# EAGLE design LAN9303_Nucleo144_Shield (EAGLE 9.1.3)
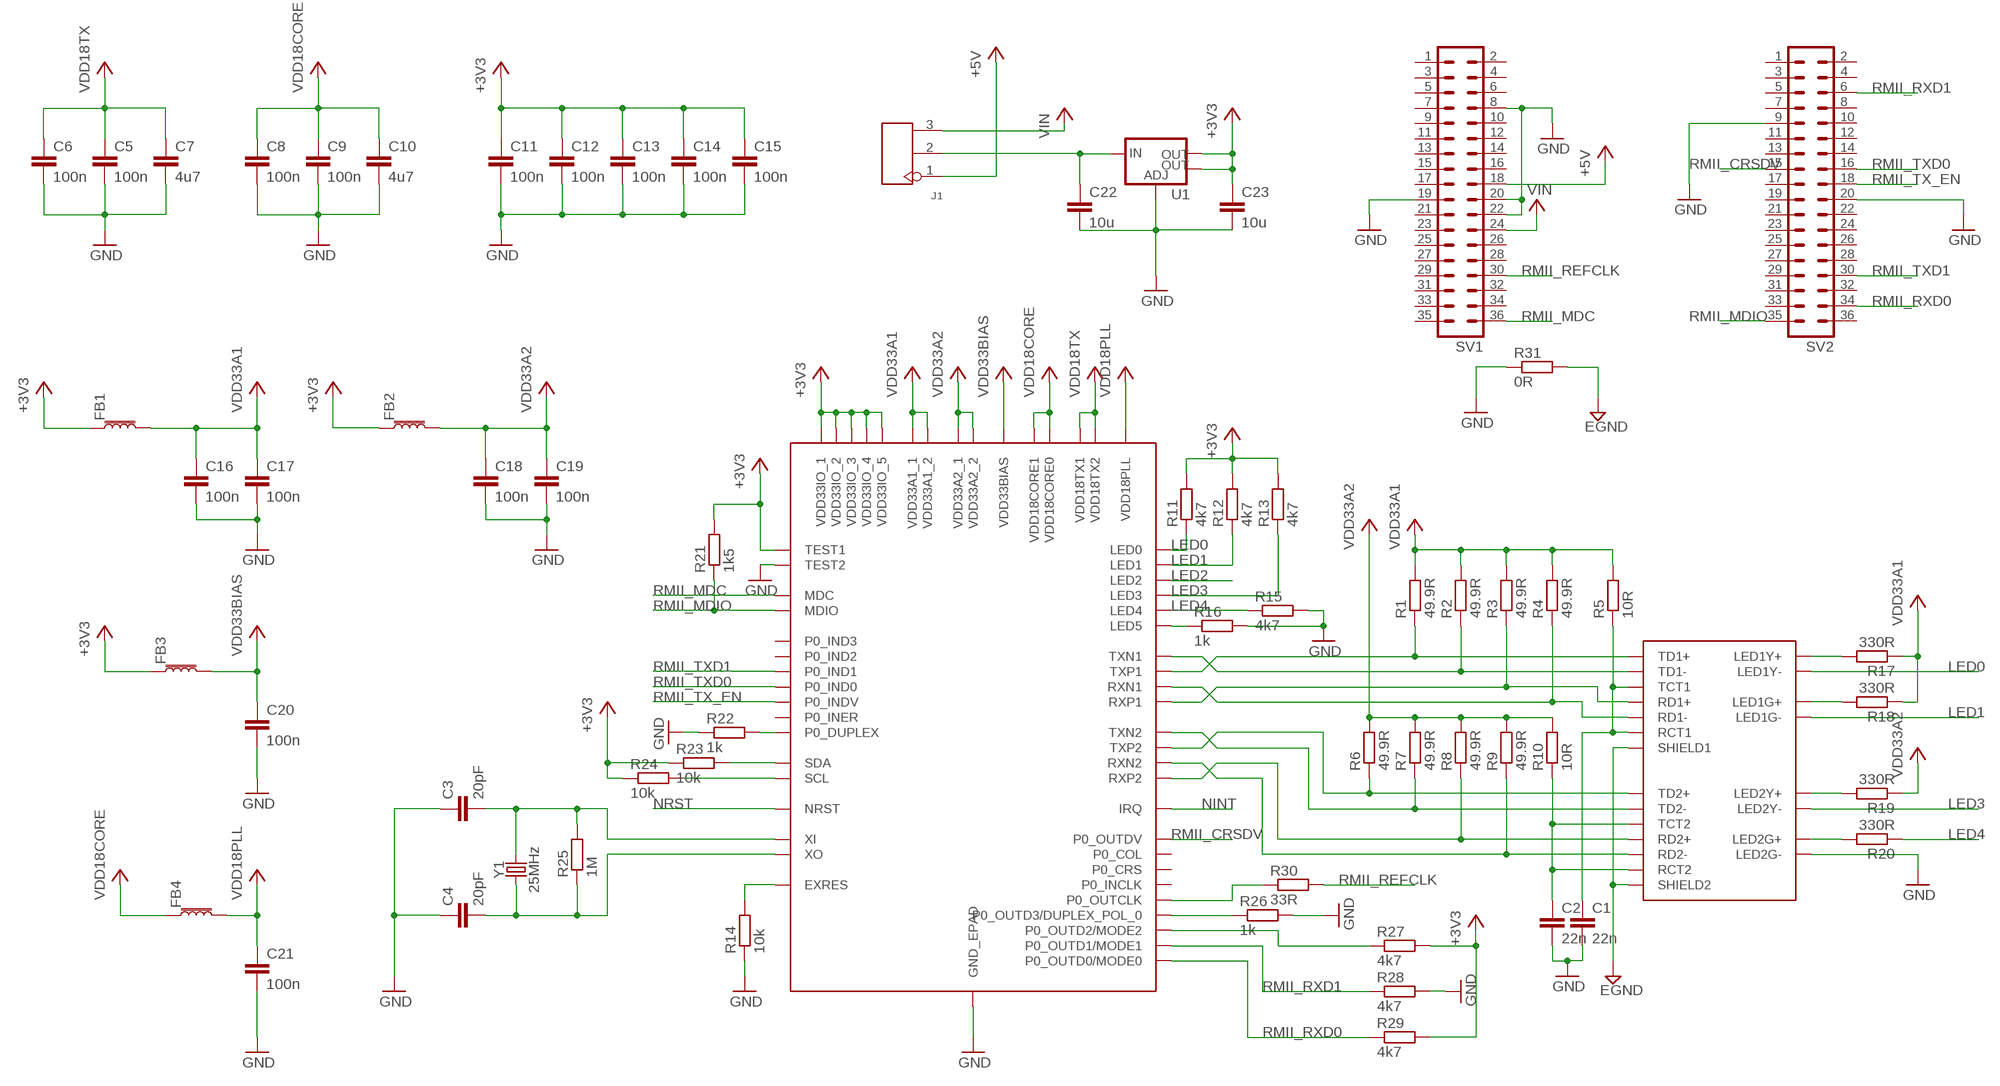
[diagram p0: schematic, sheet 1]

## Parts
C1  22n  C-EUC0603  [C0603]
C2  22n  C-EUC0603  [C0603]
C3  20pF  C-EUC0603  [C0603]
C4  20pF  C-EUC0603  [C0603]
C5  100n  C-EUC0603  [C0603]
C6  100n  C-EUC0603  [C0603]
C7  4u7  C-EUC0603  [C0603]
C8  100n  C-EUC0603  [C0603]
C9  100n  C-EUC0603  [C0603]
C10  4u7  C-EUC0603  [C0603]
C11  100n  C-EUC0603  [C0603]
C12  100n  C-EUC0603  [C0603]
C13  100n  C-EUC0603  [C0603]
C14  100n  C-EUC0603  [C0603]
C15  100n  C-EUC0603  [C0603]
C16  100n  C-EUC0603  [C0603]
C17  100n  C-EUC0603  [C0603]
C18  100n  C-EUC0603  [C0603]
C19  100n  C-EUC0603  [C0603]
C20  100n  C-EUC0603  [C0603]
C21  100n  C-EUC0603  [C0603]
C22  10u  C-EUC1206  [C1206]
C23  10u  C-EUC1206  [C1206]
FB1  FERRITE_BEAD-0603  [0603]
FB2  FERRITE_BEAD-0603  [0603]
FB3  FERRITE_BEAD-0603  [0603]
FB4  FERRITE_BEAD-0603  [0603]
J1  DIP-BLACK-FEMALE-HEADER-VERT(3P-2.54)  [H3-2.54]
R1  49.9R  R-EU_R0603  [R0603]
R2  49.9R  R-EU_R0603  [R0603]
R3  49.9R  R-EU_R0603  [R0603]
R4  49.9R  R-EU_R0603  [R0603]
R5  10R  R-EU_R0603  [R0603]
R6  49.9R  R-EU_R0603  [R0603]
R7  49.9R  R-EU_R0603  [R0603]
R8  49.9R  R-EU_R0603  [R0603]
R9  49.9R  R-EU_R0603  [R0603]
R10  10R  R-EU_R0603  [R0603]
R11  4k7  R-EU_R0603  [R0603]
R12  4k7  R-EU_R0603  [R0603]
R13  4k7  R-EU_R0603  [R0603]
R14  10k  R-EU_R0603  [R0603]
R15  4k7  R-EU_R0603  [R0603]
R16  1k  R-EU_R0603  [R0603]
R17  330R  R-EU_R0603  [R0603]
R18  330R  R-EU_R0603  [R0603]
R19  330R  R-EU_R0603  [R0603]
R20  330R  R-EU_R0603  [R0603]
R21  1k5  R-EU_R0603  [R0603]
R22  1k  R-EU_R0603  [R0603]
R23  10k  R-EU_R0603  [R0603]
R24  10k  R-EU_R0603  [R0603]
R25  1M  R-EU_R0603  [R0603]
R26  1k  R-EU_R0603  [R0603]
R27  4k7  R-EU_R0603  [R0603]
R28  4k7  R-EU_R0603  [R0603]
R29  4k7  R-EU_R0603  [R0603]
R30  33R  R-EU_R0603  [R0603]
R31  0R  R-EU_R0805  [R0805]
SV1  MA18-2  [MA18-2]
SV2  MA18-2  [MA18-2]
U1  V_REG_LM1117SOT223  [SOT223]
U$1  LAN9303  LAN9303_ABZJ  [QFN56]
U$2  WE_DUAL_RJ45JACK  [DUAL_RJ45]
Y1  25MHz  CRYSTALSMD-5X3.2-2PAD  [CRYSTAL-SMD-5X3.2-2PAD]

## Nets
+3V3: C11.1 C12.1 C13.1 C14.1 C15.1 C23.1 FB1.1 FB2.1 FB3.1 R11.2 R12.2 R13.2 R21.2 R23.1 R24.1 R27.2 R29.2 U1.2(OUT) U1.4(OUT) U$1.9(VDD33IO_1) U$1.15(VDD33IO_2) U$1.23(VDD33IO_3) U$1.30(VDD33IO_4) U$1.32(VDD33IO_5) U$1.33(TEST1)
+5V: J1.1 SV1.18
CLK_IN: R30.1 U$1.17(P0_OUTCLK)
GND: C1.2 C2.2 C3.1 C4.1 C5.2 C6.2 C7.2 C8.2 C9.2 C10.2 C11.2 C12.2 C13.2 C14.2 C15.2 C16.2 C17.2 C18.2 C19.2 C20.2 C21.2 C22.2 C23.2 R14.1 R15.2 R16.2 R22.1 R26.2 R28.2 R31.1 SV1.8 SV1.19 SV1.20 SV1.22 SV2.9 SV2.20 U1.1(ADJ) U$1.34(TEST2) U$1.EPAD(GND_EPAD) U$2.P$2_12(LED2G-)
GND1: R31.2 U$2.P$1_8(SHIELD1) U$2.P$2_8(SHIELD2) ; supply symbol labelled EGND
LED0: R11.1 U$1.29(LED0) U$2.P$1_10(LED1Y-)
LED1: R12.1 U$1.28(LED1) U$2.P$1_12(LED1G-)
LED2: U$1.27(LED2)
LED3: R13.1 U$1.26(LED3) U$2.P$2_10(LED2Y-)
LED4: R15.1 R20.1 U$1.25(LED4)
N$6: C2.1 R10.1 U$2.P$2_4(TCT2) U$2.P$2_5(RCT2)
N$9: C1.1 R5.1 U$2.P$1_4(TCT1) U$2.P$1_5(RCT1)
N$12: R22.2 U$1.20(P0_DUPLEX)
N$13: R16.1 U$1.24(LED5)
N$14: R17.2 U$2.P$1_9(LED1Y+)
N$15: R19.2 U$2.P$2_9(LED2Y+)
N$16: R20.2 U$2.P$2_11(LED2G+)
N$17: R18.2 U$2.P$1_11(LED1G+)
N$18: R23.2 U$1.35(SDA)
N$19: R24.2 U$1.36(SCL)
N$20: R14.2 U$1.49(EXRES)
N$21: R27.1 U$1.12(P0_OUTD2/MODE2)
N$22: C22.1 J1.2 U1.3(IN)
N$23: C3.2 R25.2 U$1.39(XI) Y1.P$2
N$24: C4.2 R25.1 U$1.40(XO) Y1.P$1
N$25: R26.1 U$1.11(P0_OUTD3/DUPLEX_POL_0)
NINT: U$1.38(IRQ)
NRST: U$1.37(NRST)
RMII_CRSDV: SV2.15 U$1.16(P0_OUTDV)
RMII_MDC: SV1.36 U$1.22(MDC)
RMII_MDIO: R21.1 SV2.35 U$1.21(MDIO)
RMII_REFCLK: R30.2 SV1.30
RMII_RXD0: R29.1 SV2.34 U$1.14(P0_OUTD0/MODE0)
RMII_RXD1: R28.1 SV2.6 U$1.13(P0_OUTD1/MODE1)
RMII_TX_EN: SV2.18 U$1.6(P0_INDV)
RMII_TXD0: SV2.16 U$1.5(P0_IND0)
RMII_TXD1: SV2.30 U$1.4(P0_IND1)
RXN1: R4.1 U$1.45(RXN1) U$2.P$1_6(RD1-)
RXN2: R9.1 U$1.54(RXN2) U$2.P$2_6(RD2-)
RXP1: R3.1 U$1.46(RXP1) U$2.P$1_3(RD1+)
RXP2: R8.1 U$1.53(RXP2) U$2.P$2_3(RD2+)
TXN1: R2.1 U$1.42(TXN1) U$2.P$1_2(TD1-)
TXN2: R7.1 U$1.1(TXN2) U$2.P$2_2(TD2-)
TXP1: R1.1 U$1.43(TXP1) U$2.P$1_1(TD1+)
TXP2: R6.1 U$1.56(TXP2) U$2.P$2_1(TD2+)
VDD18CORE: C8.1 C9.1 C10.1 FB4.1 U$1.10(VDD18CORE0) U$1.31(VDD18CORE1)
VDD18PLL: C21.1 FB4.2 U$1.41(VDD18PLL)
VDD18TX: C5.1 C6.1 C7.1 U$1.48(VDD18TX1) U$1.51(VDD18TX2)
VDD33A1: C16.1 C17.1 FB1.2 R1.2 R2.2 R3.2 R4.2 R5.2 R17.1 R18.1 U$1.44(VDD33A1_1) U$1.47(VDD33A1_2)
VDD33A2: C18.1 C19.1 FB2.2 R6.2 R7.2 R8.2 R9.2 R10.2 R19.1 U$1.52(VDD33A2_1) U$1.55(VDD33A2_2)
VDD33BIAS: C20.1 FB3.2 U$1.50(VDD33BIAS)
VIN: J1.3 SV1.24
Unconnected: SV1.1 SV1.2 SV1.3 SV1.4 SV1.5 SV1.6 SV1.7 SV1.9 SV1.10 SV1.11 SV1.12 SV1.13 SV1.14 SV1.15 SV1.16 SV1.17 SV1.21 SV1.23 SV1.25 SV1.26 SV1.27 SV1.28 SV1.29 SV1.31 SV1.32 SV1.33 SV1.34 SV1.35 SV2.1 SV2.2 SV2.3 SV2.4 SV2.5 SV2.7 SV2.8 SV2.10 SV2.11 SV2.12 SV2.13 SV2.14 SV2.17 SV2.19 SV2.21 SV2.22 SV2.23 SV2.24 SV2.25 SV2.26 SV2.27 SV2.28 SV2.29 SV2.31 SV2.32 SV2.33 SV2.36 U$1.2(P0_IND3) U$1.3(P0_IND2) U$1.7(P0_INER) U$1.8(P0_INCLK) U$1.18(P0_COL) U$1.19(P0_CRS)

## Library data of the parts
C1-C23 = rcl:C-EU: CAPACITOR, European symbol
FB1-FB4 = SparkFun-Coils:FERRITE_BEAD: Ferrite Bead (blocks, cores, rings, chokes, etc.) Inductor with layers of ferrite used to suppress high frequencies. Often used to isolate high frequency noise. SparkFun Products: IOIO-OTG - V2.2 <https://www.sparkfun.com/products/13613> SparkFun SAMD21 Mini Breakout <https://www.sparkfun.com/products/13664> SparkFun 6 Degrees of Freedom Breakout - LSM6DS3 <https://www.sparkfun.com/products/13339> SparkFun SAMD21 Dev Breakout <https://www.sparkfun.com/products/13672>; PROD_ID: NDUC-07859; VALUE: 30Ω/1.8A
J1 = Seeed-OPL-Connector:DIP-BLACK-FEMALE-HEADER-VERT(3P-2.54): 320030024; MPN: F185-1103A0BSYA1; VALUE: 3p-2.54
R1-R31 = rcl:R-EU_: RESISTOR, European symbol
SV1 SV2 = con-lstb:MA18-2: PIN HEADER; OC_FARNELL: unknown; OC_NEWARK: unknown
U1 = SparkFun-IC-Power:V_REG_LM1117: Voltage Regulator LM1117 Standard adjustable voltage regulator but in SMD form. Spark Fun Electronics SKU : COM-00595; PROD_ID: VREG-08170
U$1 = LAN9303_Daughter_Board:LAN9303_ABZJ
U$2 = LAN9303_Daughter_Board:WE_DUAL_RJ45JACK
Y1 = SparkFun-Clocks:CRYSTAL: Crystals (Generic) These are passive quartz crystals, which can be used as a clock source for a microcontroller. Crystal's are two-terminal devices. They require external "load" capacitors to generate an oscillating signal.

## Board
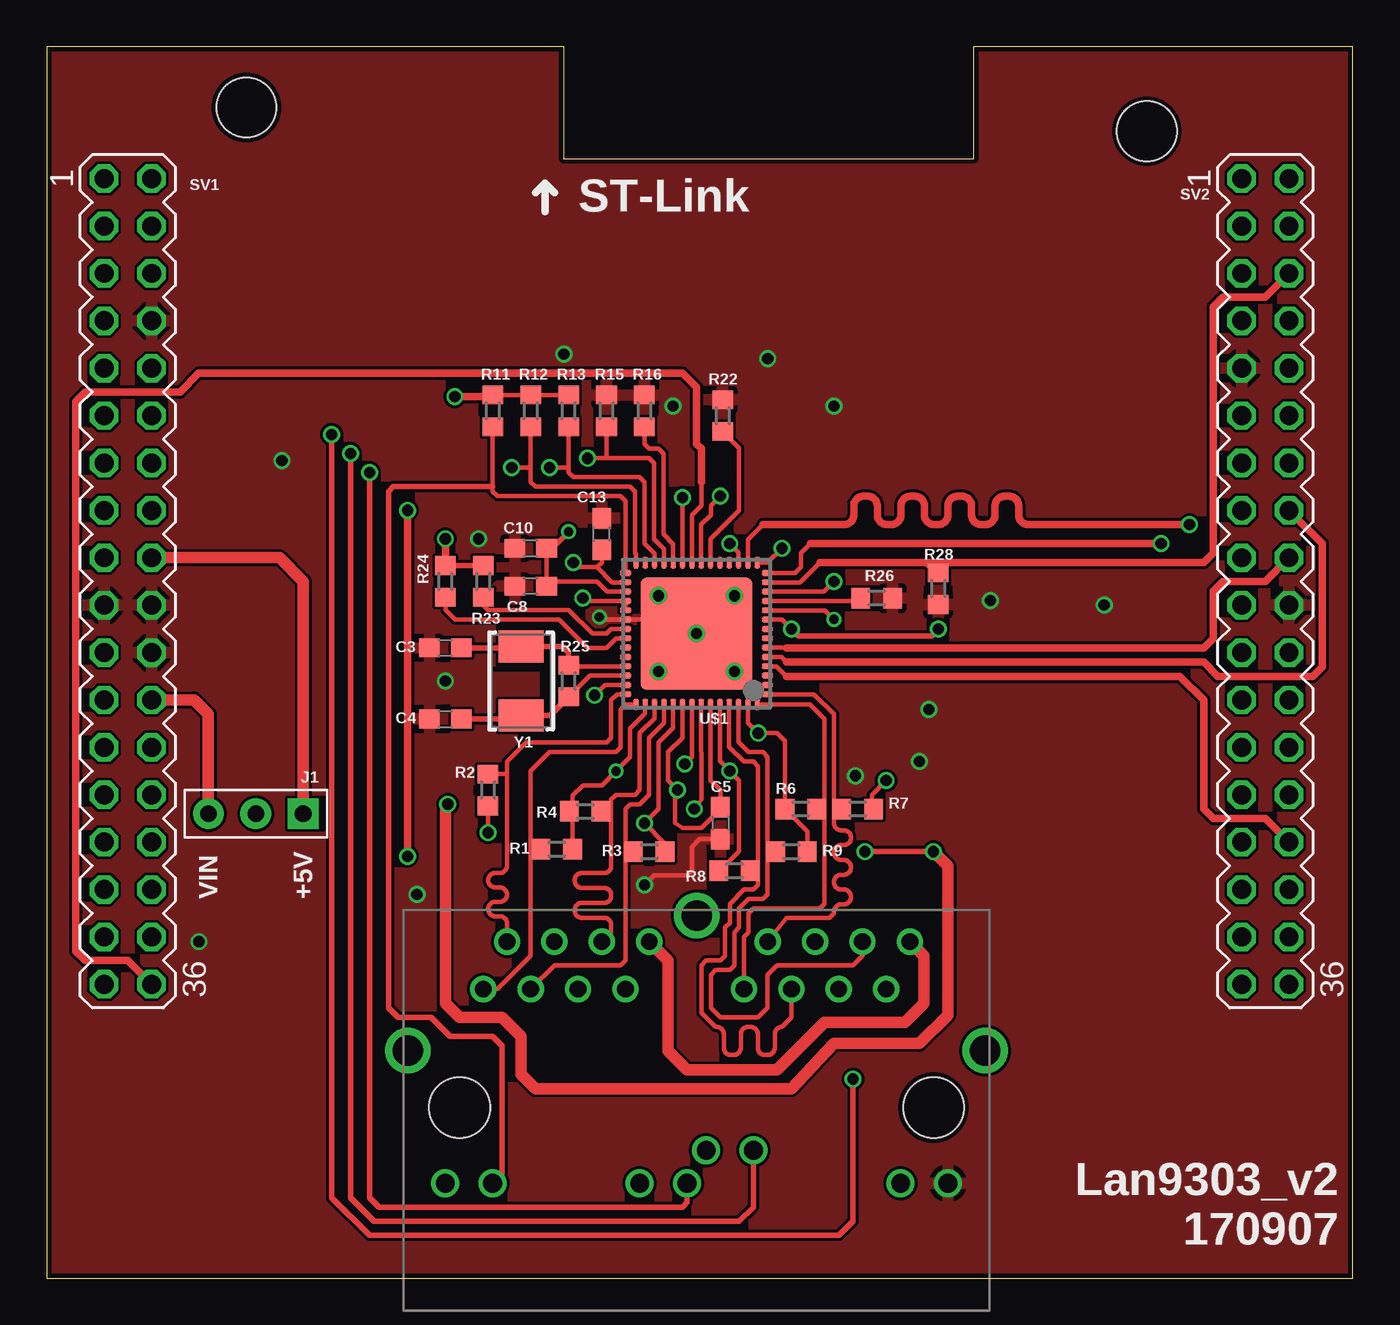
[diagram p1: board, top side]
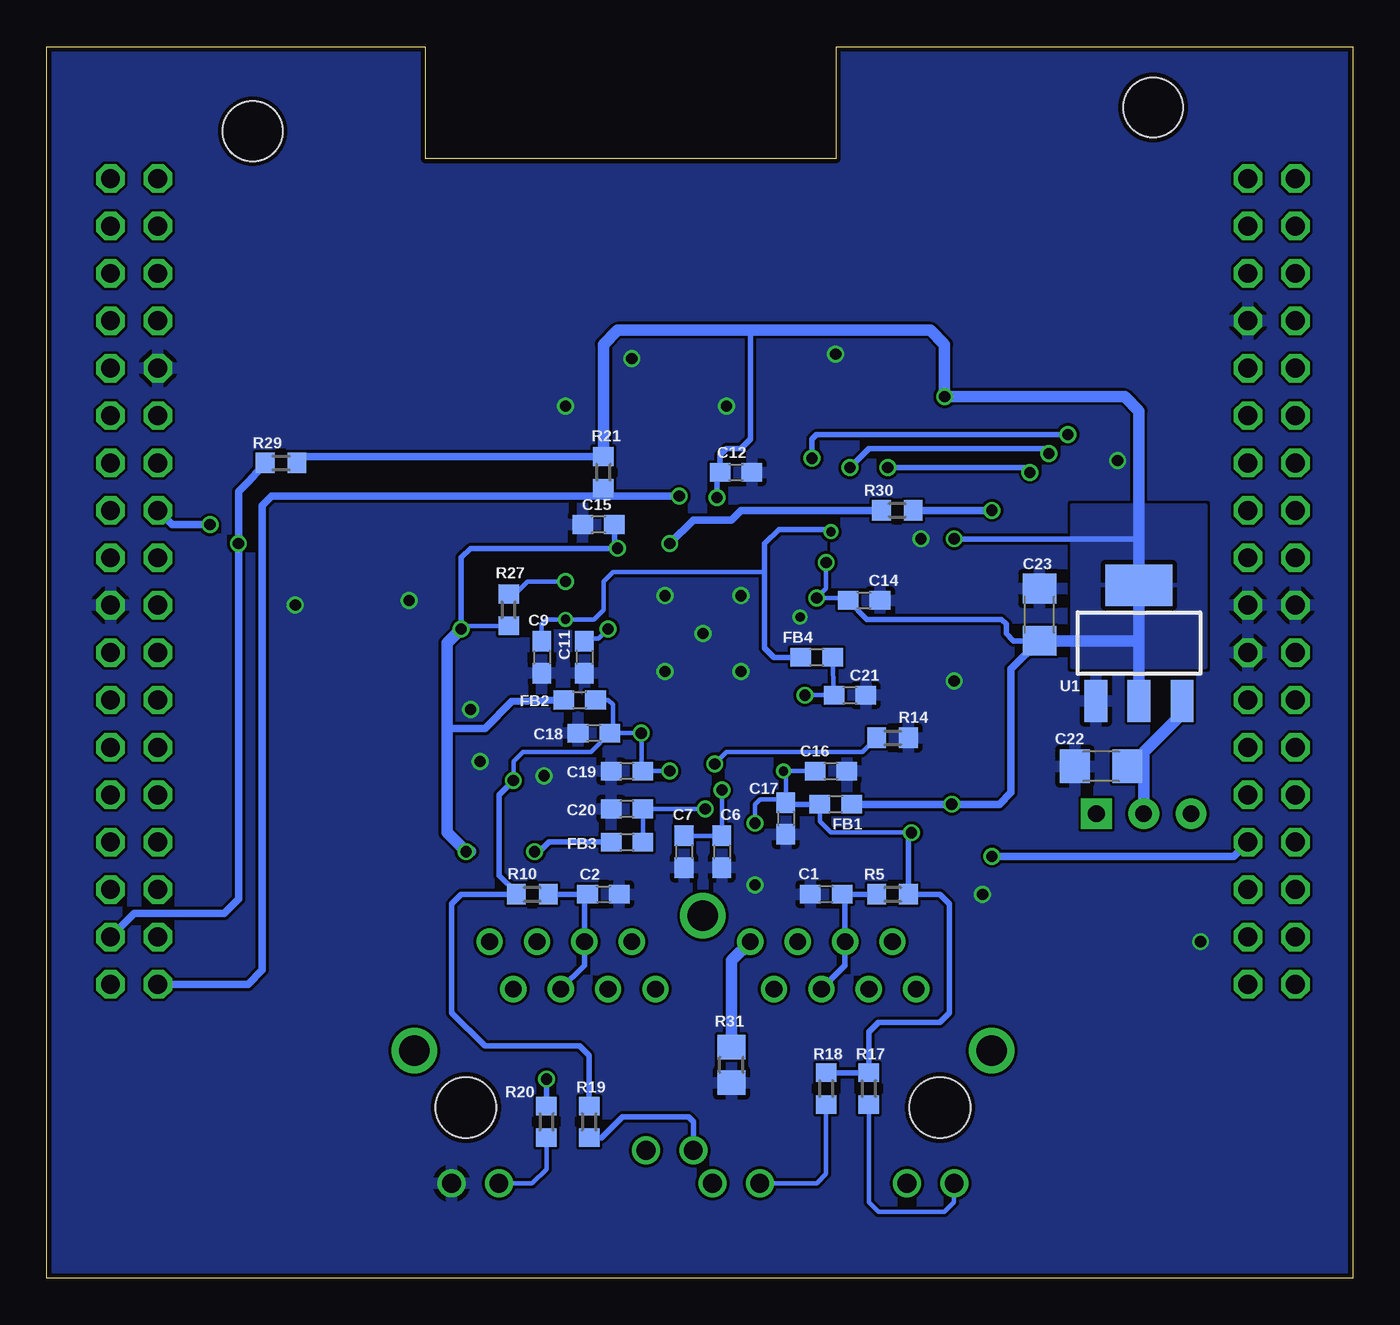
[diagram p2: board, bottom side, seen from below]

Size 70 x 66 mm. Coordinates in mm from the lower left corner, seen from the top.
Outline: 0,0 70,0 70,66 49.7,66 49.7,60 27.7,60 27.7,66 0,66 0,0
Copper layers (1*16): Top 0.035mm / dielectric 1.5mm / Bottom 0.035mm
Design rules "SeeedStudio_2layer_DRU_no_angle_20140221": minimum track width 6mil, minimum drill 12mil, track to track 6mil, track to pad 6mil, pad to pad 6mil, via to via 6mil, smd to smd 0mil, copper to edge 10mil, drill to drill 10mil, minimum pad ring 10mil, minimum via ring 6mil, stop-mask expansion 2mil, vias tented up to drill 100mil, thermal gap 10mil
Holes 3.2 mm at 58.96,61.47 10.7,62.74
tRestrict: area 29.2,39.6 to 30.3,40.1; area 33.8,37.5 to 35.8,37.7; area 37.8,33.8 to 38,35.3; area 34.1,31.4 to 35.6,31.6; area 31.7,33.9 to 31.9,35.2; area 23.9,32.5 to 26.4,32.8; area 23.9,29.7 to 26.4,30; area 26.4,31.2 to 27,32.8; area 21.1,33 to 21.6,33.3; area 21.1,30.5 to 21.6,30.7; area 21.1,29.2 to 21.6,29.5; area 22.9,25.9 to 23.1,26.4; 8 more areas
bRestrict: area 57.2,44.2 to 57.7,44.5; area 24.2,40.4 to 24.7,40.6; area 40.4,33 to 40.7,33.5; area 41.7,33 to 41.9,33.5; area 42.7,33 to 43,33.5; area 44,33 to 44.2,33.5; area 45,35.6 to 45.5,35.8; area 32.8,42.4 to 33.3,42.7; area 32.8,43.7 to 33.3,43.9; area 40.7,42.9 to 40.9,43.4; area 39.4,42.9 to 39.7,43.4; area 39.9,21.1 to 40.4,21.3; 15 more areas

### Footprints (pad centres in the part's own frame; a part is rotated, then mirrored left to right if it is on the bottom)
C0603 = smd 1.1 x 1: 1 -0.85,0; 2 0.85,0
C1206 = smd 1.6 x 1.8: 1 -1.4,0; 2 1.4,0
0603 = smd 1.1 x 1: 1 -0.85,0; 2 0.85,0
H3-2.54 = drill 0.889 pad 1.651 square: 1 0,2.54 | drill 0.889 pad 1.651: 2 0,0; 3 0,-2.54
R0603 = smd 1 x 1.1: 1 -0.85,0; 2 0.85,0
R0805 = smd 1.3 x 1.5: 1 -0.95,0; 2 0.95,0
MA18-2 = drill 1.016 octagon: 1 -21.59,-1.27; 2 -21.59,1.27; 3 -19.05,-1.27; 4 -19.05,1.27; 5 -16.51,-1.27; 6 -16.51,1.27; 7 -13.97,-1.27; 8 -13.97,1.27; 9 -11.43,-1.27; 10 -11.43,1.27; 11 -8.89,-1.27; 12 -8.89,1.27; 13 -6.35,-1.27; 14 -6.35,1.27; 15 -3.81,-1.27; 16 -3.81,1.27; 17 -1.27,-1.27; 18 -1.27,1.27; 19 1.27,-1.27; 20 1.27,1.27; 21 3.81,-1.27; 22 3.81,1.27; 23 6.35,-1.27; 24 6.35,1.27; 25 8.89,-1.27; 26 8.89,1.27; 27 11.43,-1.27; 28 11.43,1.27; 29 13.97,-1.27; 30 13.97,1.27; 31 16.51,-1.27; 32 16.51,1.27; 33 19.05,-1.27; 34 19.05,1.27; 35 21.59,-1.27; 36 21.59,1.27
SOT223 = smd 1.219 x 2.235: 1 -2.311,-3.099; 2 0,-3.099; 3 2.311,-3.099 | smd 3.6 x 2.2: 4 0,3.099
QFN56 = smd 0.6 x 0.3: 1 -3.8,3.25; 2 -3.8,2.75; 3 -3.8,2.25; 4 -3.8,1.75; 5 -3.8,1.25; 6 -3.8,0.75; 7 -3.8,0.25; 8 -3.8,-0.25; 9 -3.8,-0.75; 10 -3.8,-1.25; 11 -3.8,-1.75; 12 -3.8,-2.25; 13 -3.8,-2.75; 14 -3.8,-3.25; 29 3.8,-3.25; 30 3.8,-2.75; 31 3.8,-2.25; 32 3.8,-1.75; 33 3.8,-1.25; 34 3.8,-0.75; 35 3.8,-0.25; 36 3.8,0.25; 37 3.8,0.75; 38 3.8,1.25; 39 3.8,1.75; 40 3.8,2.25; 41 3.8,2.75; 42 3.8,3.25 | smd 0.3 x 0.6: 15 -3.25,-3.8; 16 -2.75,-3.8; 17 -2.25,-3.8; 18 -1.75,-3.8; 19 -1.25,-3.8; 20 -0.75,-3.8; 21 -0.25,-3.8; 22 0.25,-3.8; 23 0.75,-3.8; 24 1.25,-3.8; 25 1.75,-3.8; 26 2.25,-3.8; 27 2.75,-3.8; 28 3.25,-3.8; 43 3.25,3.8; 44 2.75,3.8; 45 2.25,3.8; 46 1.75,3.8; 47 1.25,3.8; 48 0.75,3.8; 49 0.25,3.8; 50 -0.25,3.8; 51 -0.75,3.8; 52 -1.25,3.8; 53 -1.75,3.8; 54 -2.25,3.8; 55 -2.75,3.8; 56 -3.25,3.8 | smd 6 x 6: EPAD 0,0
DUAL_RJ45 = drill 1.63: P$1 -15.465,-3.05; P$2 15.465,-3.05; P$3 0,-10.29 | drill 0.9: P$1_1 11.43,-6.35; P$1_2 10.16,-8.89; P$1_3 8.89,-6.35; P$1_4 7.62,-8.89; P$1_5 6.35,-6.35; P$1_6 5.08,-8.89; P$1_7 3.81,-6.35; P$1_8 2.54,-8.89; P$2_1 -2.54,-6.35; P$2_2 -3.81,-8.89; P$2_3 -5.08,-6.35; P$2_4 -6.35,-8.89; P$2_5 -7.62,-6.35; P$2_6 -8.89,-8.89; P$2_7 -10.16,-6.35; P$2_8 -11.43,-8.89 | drill 1: P$1_9 13.47,4.06; P$1_10 10.93,4.06; P$1_11 3.05,4.06; P$1_12 0.51,4.06; P$2_9 -0.51,2.29; P$2_10 -3.05,2.29; P$2_11 -10.93,4.06; P$2_12 -13.47,4.06 | hole 3.25: -12.7,0; 12.7,0
CRYSTAL-SMD-5X3.2-2PAD = smd 1.7 x 2.4: P$1 1.85,0; P$2 -1.85,0

### Placement (x,y rotation side)
C1  28.23,20.57 180 bottom
C2  40.16,20.57 0 bottom
C3  21.37,33.78 0 top
C4  21.37,29.97 0 top
C5  36.1,24.38 270 top
C6  33.81,22.86 270 bottom
C7  35.85,22.86 270 bottom
C8  25.94,37.08 180 top
C9  43.47,33.27 270 bottom
C10  25.94,39.12 180 top
C11  41.18,33.27 270 bottom
C12  33.05,43.18 0 bottom
C13  29.75,39.88 90 top
C14  26.19,36.32 0 bottom
C15  40.42,40.39 180 bottom
C16  27.97,27.18 0 bottom
C17  30.38,24.64 270 bottom
C18  40.67,29.21 180 bottom
C19  38.89,27.18 180 bottom
C20  38.89,25.15 180 bottom
C21  26.96,31.24 0 bottom
C22  13.49,27.43 180 bottom
C23  16.8,35.56 90 bottom
FB1  27.72,25.4 180 bottom
FB2  41.43,30.99 0 bottom
FB3  38.89,23.37 0 bottom
FB4  28.73,33.27 0 bottom
J1  11.21,24.89 270 top
R1  27.34,22.99 0 top
R2  23.65,26.16 270 top
R3  32.29,22.86 0 top
R4  28.86,25.02 180 top
R5  24.67,20.57 0 bottom
R6  40.42,25.15 180 top
R7  43.47,25.15 0 top
R8  36.86,21.84 180 top
R9  39.91,22.86 0 top
R10  43.97,20.57 180 bottom
R11  23.91,46.48 90 top
R12  25.94,46.48 90 top
R13  27.97,46.48 90 top
R14  24.67,28.96 180 bottom
R15  30,46.48 90 top
R16  32.04,46.48 90 top
R17  25.94,10.16 270 bottom
R18  28.23,10.16 270 bottom
R19  40.93,8.38 270 bottom
R20  43.21,8.38 270 bottom
R21  40.16,43.18 90 bottom
R22  36.23,46.23 270 top
R23  23.4,37.34 270 top
R24  21.37,37.34 270 top
R25  27.97,32 90 top
R26  44.48,36.45 0 top
R27  45.24,35.81 270 bottom
R28  47.78,36.96 270 top
R29  57.44,43.69 0 bottom
R30  24.42,41.15 0 bottom
R31  33.31,11.43 90 bottom
SV1  4.35,37.34 270 top
SV2  65.31,37.34 270 top
U1  11.46,34.04 0 bottom
U$1  34.83,34.54 180 top
U$2  34.83,9.14 180 top
Y1  25.43,32 270 top

### Tracks (layer width: path | path; a pad name or v marks a point on that pad's centre or on a via)
+3V3  (via drill 0.6)
  Top 0.254: v39.91,34.8 39.4,35.31 38.64,35.31 U$1.9 | U$1.23 v34.08,41.83 | v28.73,36.45 29.02,36.29 U$1.32 U$1.33 | R11.2 R12.2 R13.2 | 29.5,38.1 30.3,37.29 U$1.30 | 29.5,38.1 28.48,38.1 v28.23,38.35 | U$1.15 38.63,38.34 v39.4,39.12 | C13.1 29.75,38.35 29.5,38.1
  Top 0.305: R24.1 R23.1 | v43.85,22.86 v47.53,22.86 | v47.78,34.8 47.4,34.42 40.29,34.42 v39.91,34.8
  Top 0.406: v21.88,47.24 23.74,47.24 R11.2 | v21.37,39.62 R24.1
  Top 0.61: v47.53,22.86 48.29,22.1 48.29,14.1 46.77,12.57 42.2,12.57 39.91,10.16 26.19,10.16 25.43,10.92 25.43,12.95 24.42,13.97 22.13,13.97 21.37,14.73 21.37,25.27 v21.5,25.4
  Bottom 0.254: v39.91,34.8 40.42,34.29 41.27,34.29 C11.1 | C14.1 27.17,36.45 v28.73,36.45 28.23,36.96 v28.23,38.35 | R27.2 47.62,34.96 v47.78,34.8
  Bottom 0.305: C23.1 18.19,34.16 18.57,34.54 18.57,35.05 18.83,35.31 26.03,35.31 C14.1 27.21,36.49 | v21.37,39.62 11.46,39.62 | FB3.1 43.09,23.37 43.85,22.61 v43.85,22.86 | 32.29,50.8 32.38,50.71 32.29,50.62 32.29,44.96 32.8,44.45 33.56,44.45 33.9,44.11 C12.1 34.08,43 v34.08,41.83 | v47.78,34.8 47.78,38.61 47.28,39.12 v39.4,39.12 39.57,39.28 C15.1
  Bottom 0.406: FB1.1 v21.5,25.4 18.95,25.4 18.32,26.04 18.32,32.64 C23.1 | FB2.1 45.08,30.9 46.51,29.46 48.55,29.46 | R21.2 56.24,44.03 R29.2
  Bottom 0.61: 11.46,34.29 U1.4 11.46,39.62 11.46,46.48 12.22,47.24 v21.88,47.24 21.88,50.04 22.64,50.8 32.29,50.8 39.4,50.8 40.16,50.04 R21.2 | 11.46,34.29 U1.2 | C23.1 11.59,34.16 11.46,34.29 | 47.28,22.86 v47.53,22.86 48.55,23.88 48.55,29.46 48.55,34.04 v47.78,34.8
  pour Bottom: 7.91,41.4 7.91,32.77 15.02,32.77 15.02,41.4
+5V
  Top 0.61: SV1.18 12.48,38.61 13.75,37.34 J1.1
CLK_IN  (via drill 0.6)
  Top 0.254: U$1.17 37.08,38.9 v36.61,39.37
  Bottom 0.406: v36.61,39.37 35.34,40.64 33.31,40.64 32.8,41.15 R30.1
GND  (via drill 0.5, 0.6)
  Top 0.254: v29.62,35.43 29.76,35.29 U$1.34 34.08,35.29 U$1.EPAD | C5.2 35,23.53 34.58,23.11 34.58,21.84 34.32,21.59 32.54,21.59 v32.04,21.08
  Bottom 0.254: v29.62,35.43 29.5,35.56
  other vias: 33.56,46.74 38.64,49.28 42.2,46.74 23.15,39.62 19.84,20.57 46.77,27.69 50.58,36.32 12.61,43.81 36.86,32.51 21.37,32 47.28,30.48 8.16,18.03 43.34,26.92 34.83,34.54 36.86,36.58 32.8,36.58 32.8,32.51 56.67,36.07 27.72,49.53
  pour Bottom (rank 2): -2,0 -2,66.04 71.41,66.04 71.41,0
  pour Top: -2,0 -2,66.04 71.41,66.04 71.41,0
GND1
  Top 0.61: U$2.P$1_8 33.31,17.02 33.31,12.19 34.32,11.18 39.15,11.18 41.69,13.72 46.01,13.72 47.02,14.73 47.02,17.27 U$2.P$2_8
  Bottom 0.61: R31.2 33.31,17.02 U$2.P$1_8
LED0
  Top 0.254: R11.1 23.91,42.42 23.91,42.16 24.16,41.91 30.77,41.91 31.02,41.66 31.02,38.1 31.03,38.09 U$1.29
  Top 0.305: 23.91,42.42 18.57,42.42 18.32,42.16 18.32,14.48 18.83,13.97 20.61,13.97 21.62,12.95 23.91,12.95 24.42,12.45 24.42,5.6 U$2.P$1_10 23.91,5.09
LED1  (via drill 0.6)
  Top 0.254: 25.94,43.43 25.94,42.67 26.19,42.42 31.27,42.42 31.53,42.16 31.53,38.86 31.58,38.81 U$1.28 | 25.94,43.43 R12.1 | 25.94,43.43 v24.92,43.43
  Top 0.305: v17.3,43.18 17.3,4.32 17.81,3.81 34.07,3.81 34.32,4.06 U$2.P$1_12
  Bottom 0.305: v24.92,43.43 17.56,43.43 v17.3,43.18
LED3  (via drill 0.6)
  Top 0.254: U$1.26 32.58,38.83 32.04,39.37 32.04,42.67 31.78,42.93 28.23,42.93 27.97,43.18 R13.1 27.97,43.43 v26.96,43.43
  Top 0.305: v16.29,44.2 16.29,4.32 17.56,3.05 37.12,3.05 37.88,3.81 U$2.P$2_10
  Bottom 0.305: v26.96,43.43 25.94,44.45 16.54,44.45 v16.29,44.2
LED4  (via drill 0.6)
  Top 0.254: U$1.25 33.08,39.09 32.54,39.62 32.54,43.69 32.29,43.94 30,43.94 | 30,43.94 v28.99,43.94 | 30,43.94 R15.1
  Top 0.305: v15.27,45.21 15.27,4.32 17.3,2.29 42.45,2.29 43.21,3.05 v43.21,10.67
  Bottom 0.305: v28.99,43.94 28.99,44.96 28.73,45.21 v15.27,45.21 | v43.21,10.67 R20.1
N$6
  Bottom 0.305: U$2.P$2_5 41.18,16.76 U$2.P$2_4 41.18,20.32 41.43,20.57 C2.1 R10.1
N$9
  Bottom 0.305: 27.46,20.57 C1.1 R5.1 | 27.72,20.57 27.46,20.57 | 27.46,20.57 27.21,20.32 U$2.P$1_4 27.21,16.76 U$2.P$1_5
N$12
  Top 0.254: U$1.20 35.58,39.61 37.12,41.15 37.12,44.49 R22.2
N$13
  Top 0.254: U$1.24 33.58,39.35 33.05,39.88 33.05,44.2 32.8,44.45 32.29,44.45 32.04,44.7 R16.1
N$14
  Bottom 0.254: R17.2 25.94,4.06 25.43,3.56 21.88,3.56 21.37,4.06 U$2.P$1_9
N$15
  Bottom 0.305: R19.2 40.25,7.53 39.15,8.64 35.59,8.64 35.34,8.38 U$2.P$2_9
N$16
  Bottom 0.254: R20.2 43.21,5.84 43.97,5.08 U$2.P$2_11
N$17
  Bottom 0.254: U$2.P$1_11 28.73,5.08 28.23,5.59 R18.2
N$18
  Top 0.254: R23.2 23.4,36.07 23.65,35.81 27.97,35.81 29.24,34.54 30,34.54 30.26,34.8 U$1.35
N$19
  Top 0.254: R24.2 21.37,35.81 21.88,35.31 27.46,35.31 28.99,33.78 30,33.78 30.52,34.29 U$1.36
N$20  (via drill 0.6)
  Top 0.254: U$1.49 34.58,27.94 v34.2,27.56
  Bottom 0.254: v34.2,27.56 33.56,28.19 26.28,28.19 R14.2
N$21  (via drill 0.6)
  Top 0.254: U$1.12 41.65,36.79 v42.2,37.34
  Bottom 0.254: R27.1 44.9,36.66 44.23,37.34 v42.2,37.34
N$22
  Bottom 0.61: J1.2 11.21,27.69 | 11.21,27.69 11.21,28.19 9.18,30.23 9.18,30.91 U1.3 | C22.1 11.46,27.43 11.21,27.69
N$23
  Top 0.254: U$1.39 27.97,32.79 R25.2
  Top 0.305: C3.2 25.36,33.78 Y1.P$2 27.65,33.85 27.97,33.53 R25.2
N$24
  Top 0.254: U$1.40 29.11,32.29 R25.1
  Top 0.305: C4.2 25.25,29.97 Y1.P$1 26.97,30.15 R25.1
N$25
  Top 0.254: U$1.11 43.63,36.29 R26.1
RMII_CRSDV  (via drill 0.6)
  Top 0.254: U$1.16 37.58,39.58 38.39,40.39
  Top 0.406: 38.39,40.39 42.73,40.39 arc90 43.25,40.91 43.25,41.39 arc-90 43.77,41.91 43.99,41.91 arc-90 44.52,41.39 44.52,40.91 arc90 45.04,40.39 45.26,40.39 arc90 45.78,40.91 45.78,41.39 arc-90 46.3,41.91 46.52,41.91 arc-90 47.04,41.39 47.04,40.91 arc90 47.56,40.39 47.78,40.39 arc90 48.3,40.91 48.3,41.39 arc-90 48.82,41.91 49.04,41.91 arc-90 49.56,41.39 49.56,40.91 arc90 50.09,40.39 50.31,40.39 arc90 50.83,40.91 50.83,41.39 arc-90 51.35,41.91 51.57,41.91 arc-90 52.09,41.39 52.09,40.91 arc90 52.61,40.39 v61.25,40.39
  Bottom 0.406: v61.25,40.39 63.28,40.39 SV2.15
RMII_MDC
  Top 0.254: U$1.22 34.58,40.9 35.08,41.4 35.08,42.67
  Top 0.406: SV1.36 4.35,17.02 2.06,17.02 1.56,17.53 1.56,46.99 2.06,47.5 7.14,47.5 8.16,48.51 34.07,48.51 34.83,47.75 34.83,44.7 35.08,44.45 35.08,42.67
RMII_MDIO  (via drill 0.6)
  Top 0.254: U$1.21 35.08,40.38 35.59,40.89 35.59,41.4 v36.1,41.91
  Bottom 0.305: 39.74,41.91 R21.1
  Bottom 0.406: v36.1,41.91 39.74,41.91 57.94,41.91 58.45,41.4 58.45,16.51 59.21,15.75 SV2.35
RMII_REFCLK  (via drill 0.6)
  Top 0.406: v19.34,41.15 v19.34,22.61
  Bottom 0.406: R30.2 v19.34,41.15 | v19.34,22.61 6.38,22.61 SV1.30
RMII_RXD0  (via drill 0.6)
  Top 0.254: U$1.14 40.11,37.79 40.42,38.1 40.42,38.86 40.93,39.37
  Top 0.406: 40.93,39.37 v59.72,39.37
  Bottom 0.406: R29.1 59.21,42.67 59.72,42.16 v59.72,39.37 59.72,20.32 60.48,19.56 65.31,19.56 SV2.34
RMII_RXD1
  Top 0.254: U$1.13 40.37,37.29 41.43,38.35
  Top 0.305: R28.1 47.02,38.35
  Top 0.406: 41.43,38.35 47.02,38.35 62.01,38.35 62.52,38.86 62.52,52.07 63.02,52.58 65.31,52.58 SV2.6
RMII_TX_EN
  Top 0.254: U$1.6 39.4,33.79 39.66,33.78
  Top 0.406: 39.66,33.78 62.01,33.78 62.52,34.29 62.52,36.83 63.02,37.34 65.31,37.34 SV2.18
RMII_TXD0
  Top 0.254: U$1.5 39.38,33.29 39.66,33.02
  Top 0.406: 39.66,33.02 62.01,33.02 62.77,32.26 67.85,32.26 68.36,32.77 68.36,39.37 SV2.16
RMII_TXD1
  Top 0.254: U$1.4 39.12,32.79 39.66,32.26
  Top 0.406: 39.66,32.26 60.74,32.26 62.01,30.99 62.01,25.15 62.52,24.64 65.31,24.64 SV2.30
RXN1
  Top 0.254: U$1.45 32.58,30.01 31.78,29.21 31.78,26.16 31.53,25.91 30.51,25.91 30.26,25.65 30.26,24.89 | 30.26,24.89 30.26,22.1 arc-90 29.88,21.72 28.68,21.72 arc90 28.3,21.34 28.3,21.3 arc90 28.68,20.91 29.88,20.91 arc-90 30.26,20.53 30.26,20.49 arc-90 29.88,20.11 28.68,20.11 arc90 28.3,19.73 28.3,19.69 arc90 28.68,19.31 29.88,19.31 arc-90 30.26,18.93 30.26,18.54 U$2.P$1_6 | R4.1 30.13,25.02 30.26,24.89
RXN2
  Top 0.254: U$2.P$2_6 43.72,17.27 43.21,16.76 39.15,16.76 38.64,16.26 38.64,14.48 38.13,13.97 36.1,13.97 35.59,14.48 35.59,16.26 35.85,16.51 36.61,16.51 36.86,16.76 36.86,18.54 37.12,18.8 37.12,19.81 37.62,20.32 38.39,20.32 38.64,20.57 38.64,22.86 | U$1.54 37.08,28.74 37.62,28.19 38.39,28.19 38.64,27.94 38.64,22.86 | R9.1 38.64,22.86
RXP1
  Top 0.254: U$1.46 33.08,29.75 32.29,28.96 32.29,25.91 31.78,25.4 31.27,25.4 31.02,25.15 31.02,22.35 | 31.02,22.35 31.02,17.02 30.77,16.76 27.21,16.76 U$2.P$1_3 | R3.1 31.02,22.35
RXP2
  Top 0.254: U$2.P$2_3 39.91,13.97 39.4,13.46 arc90 39.02,13.08 39.02,12.35 arc-90 38.64,11.96 38.49,11.96 arc-90 38.11,12.35 38.11,13.08 arc90 37.73,13.46 37.58,13.46 arc90 37.2,13.08 37.2,12.35 arc-90 36.82,11.96 36.67,11.96 arc-90 36.29,12.35 36.29,13.08 arc90 35.91,13.46 35.85,13.46 35.08,14.22 35.08,16.76 35.34,17.02 36.1,17.02 36.35,17.27 36.35,18.8 36.61,19.05 36.61,20.07 37.37,20.83 37.88,20.83 38.13,21.08 38.13,22.1 | U$1.53 36.58,28.48 37.37,27.69 37.88,27.69 38.13,27.43 38.13,22.1 | R8.1 38.13,22.1
TXN1
  Top 0.254: U$2.P$1_2 24.67,19.01 arc90 24.29,19.39 24.04,19.39 arc-90 23.66,19.77 23.66,19.79 arc-90 24.04,20.17 24.29,20.17 arc90 24.67,20.55 24.67,20.56 arc90 24.29,20.94 24.04,20.94 arc-90 23.66,21.32 23.66,21.34 arc-90 24.04,21.72 24.29,21.72 arc90 24.67,22.1 24.67,26.92 | 24.67,26.92 24.67,27.69 25.69,28.7 30,28.7 30.26,28.96 30.26,30.99 30.56,31.29 U$1.42 | R2.1 24.58,27.01 24.67,26.92
TXN2
  Top 0.254: U$1.1 41.13,31.29 42.2,30.23 42.2,25.15 | 42.2,25.15 42.2,24.38 arc90 42.58,24 42.72,24 arc-90 43.1,23.62 43.1,23.59 arc-90 42.72,23.21 42.58,23.21 arc90 42.2,22.83 42.2,22.8 arc90 42.58,22.42 42.72,22.42 arc-90 43.1,22.04 43.1,22 arc-90 42.72,21.62 42.58,21.62 arc90 42.2,21.24 42.2,21.21 arc90 42.58,20.83 42.72,20.83 arc-90 43.1,20.45 43.1,20.42 arc-90 42.72,20.04 42.58,20.04 arc90 42.2,19.65 42.2,19.56 41.94,19.3 39.66,19.3 U$2.P$2_2 | R7.1 42.2,25.15
TXP1
  Top 0.254: 25.94,22.86 25.94,27.18 26.96,28.19 30.51,28.19 30.77,28.45 30.77,30.48 31.03,30.74 U$1.43 | 25.94,22.86 25.94,17.27 24.16,15.49 U$2.P$1_1 | R1.1 26.07,22.99 25.94,22.86
TXP2
  Top 0.254: U$1.56 40.92,30.74 41.69,29.97 41.69,25.4 | 41.18,24.89 41.27,24.98 R6.1 41.43,25.15 41.69,25.4 | 41.69,25.4 41.69,20.07 41.43,19.81 37.88,19.81 37.62,19.56 37.62,18.54 37.37,18.29 U$2.P$2_1
VDD18CORE  (via drill 0.5)
  Top 0.254: U$1.10 41.71,35.79 v42.2,35.31 | U$1.31 30.04,36.79 29.5,37.34 27.04,37.34 C8.1 C10.1
  Top 0.305: v27.97,40.01 26.96,38.95 C10.1
  Bottom 0.254: C9.1 43.47,35.05 43.21,35.31 v42.2,35.31 40.67,35.31 40.16,35.81 40.16,37.34 39.66,37.85 31.53,37.85
  Bottom 0.305: FB4.1 31.02,33.27 31.53,33.78 31.53,37.85 31.53,39.37 30.77,40.13 28.1,40.13 v27.97,40.01
VDD18PLL  (via drill 0.6)
  Top 0.254: U$1.41 29.92,31.79 v29.37,31.24
  Bottom 0.254: v29.37,31.24 C21.1 FB4.2
VDD18TX  (via drill 0.6)
  Top 0.254: U$1.48 34.07,30.73 34.07,28.96 33.31,28.19 33.31,26.67 v33.81,26.16 33.69,26.04 33.69,24.38 34.07,24.13 35.08,24.13 36.1,25.15 C5.1 36.1,26.16 35.58,26.68 U$1.51
  Bottom 0.254: v33.81,26.16 C6.1 C7.1
VDD33A1  (via drill 0.5, 0.6)
  Top 0.254: U$1.47 33.58,29.48 32.8,28.7 32.8,25.15 v32.04,24.38 33.14,23.28 R3.2 | R2.2 v23.65,23.88 | R1.2 28.19,24.84 | 28.19,24.84 R4.2 | U$1.44 32.08,30.27 31.27,29.46 31.27,27.94 v30.51,27.18 29.75,26.42 28.73,26.42 28.19,25.87 28.19,24.84
  Bottom 0.254: v32.04,24.38 32.04,25.4 31.78,25.65 30.55,25.65 C17.1 | FB1.2 28.57,24.47 27.97,23.88 v23.65,23.88 | 30.35,25.53 C17.1 | C16.1 v30.51,27.18 30.38,27.05 C17.1
  Bottom 0.305: v23.65,23.88 23.82,23.71 R5.2 22.13,20.57 21.62,20.07 21.62,14.22 22.13,13.72 25.43,13.72 25.94,13.21 R17.1 R18.1 | FB1.2 30.3,25.4 C17.1
VDD33A2  (via drill 0.6)
  Top 0.254: U$1.55 37.58,29.76 v38.13,29.21 39.15,29.21 39.57,28.79 R6.2 40.76,23.95 R9.2 | U$1.52 36.08,27.71 v36.61,27.18 37.12,26.67 37.12,22.86 36.1,21.84 R8.2 | 44.32,25.31 R7.2 44.23,25.23 44.23,25.91 v44.99,26.67
  Bottom 0.254: C18.1 v38.13,29.21 38.13,27.18 | v36.61,27.18 C19.1 | FB2.2 39.91,30.99 39.66,30.73 39.66,29.38 C18.1 | C18.1 40.84,28.19 44.48,28.19 44.99,27.69 v44.99,26.67
  Bottom 0.305: v44.99,26.67 45.75,25.91 45.75,21.59 44.82,20.66 R10.2 47.78,20.57 48.29,20.07 48.29,14.22 46.51,12.45 41.43,12.45 40.93,11.94 R19.1 | 38.13,27.18 C19.1
VDD33BIAS  (via drill 0.6)
  Top 0.254: U$1.50 35.09,25.65 v34.7,25.15
  Bottom 0.254: v34.7,25.15 C20.1 FB3.2
VIN
  Top 0.61: SV1.24 7.91,30.99 8.67,30.23 J1.3

### Text on the board
tPlace: ST-Link | VIN | +5V | Lan9303_v2 / 170907